# EAGLE design RC_RX_CABELL_V3_FHSS_No_Diversity_No_SBUS (EAGLE 7.5.0)
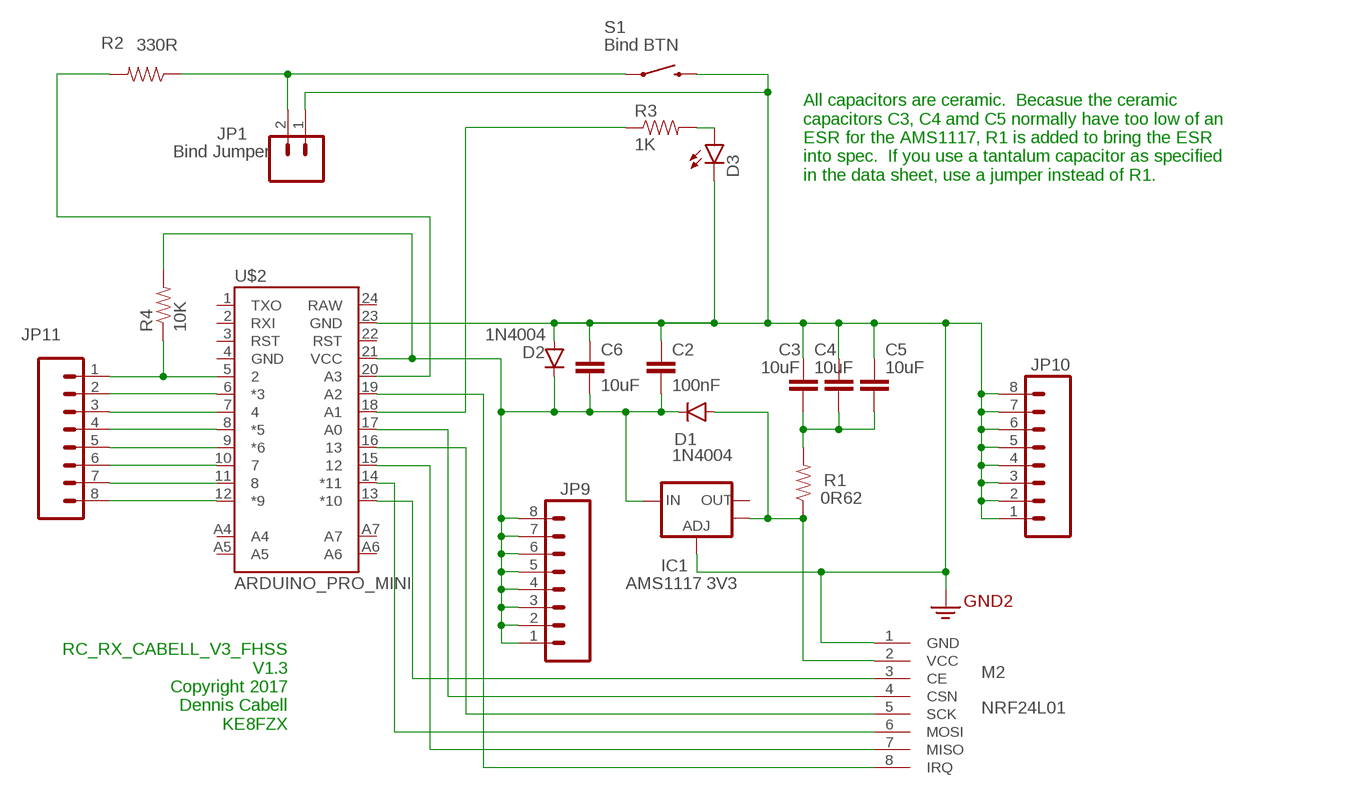
[diagram p0: schematic, sheet 1]

## Parts
C2  100nF  CAPPTH1  [CAP-PTH-5MM]
C3  10uF  CAPPTH1  [CAP-PTH-5MM]
C4  10uF  CAPPTH1  [CAP-PTH-5MM]
C5  10uF  CAPPTH1  [CAP-PTH-5MM]
C6  10uF  CAPPTH1  [CAP-PTH-5MM]
D1  1N4004  DIODEPTH  [DIODE-1N4001]
D2  1N4004  DIODEPTH  [DIODE-1N4001]
D3  LED3MM  [LED3MM]
IC1  AMS1117 3V3  V_REG_LM1117SOT223  [SOT223]
JP1  Bind Jumper  M02PTH  [1X02]
JP9  M08  [1X08_ROUND]
JP10  M08  [1X08_ROUND]
JP11  M08  [1X08_ROUND]
M2  NRF24L01  WIRELESS-NRF24L01  [WIRELESS-NRF24L01]
R1  0R62  RESISTORPTH-1/2W  [AXIAL-0.5]
R2  330R  RESISTORAXIAL-0.3  [AXIAL-0.3]
R3  1K  RESISTORAXIAL-0.3  [AXIAL-0.3]
R4  10K  RESISTORAXIAL-0.3  [AXIAL-0.3]
S1  Bind BTN  SWITCH-MOMENTARY-2SMD-1101NE  [TACTILE-SWITCH-1101NE]
U$2  ARDUINO_PRO_MINI  [ARDUINO_PRO_MINI]

## Nets
5V: C2.2 C6.2 D1.C D2.C IC1.3(IN) JP9.1 JP9.2 JP9.3 JP9.4 JP9.5 JP9.6 JP9.7 JP9.8 R4.P$2 U$2.21(VCC)
GND: C2.1 C3.1 C4.1 C5.1 C6.1 D2.A D3.K(C) IC1.1(ADJ) JP1.1 JP10.1 JP10.2 JP10.3 JP10.4 JP10.5 JP10.6 JP10.7 JP10.8 M2.1(GND) S1.2 U$2.23(GND) ; supply symbol labelled GND2
N$1: JP11.1 R4.P$1 U$2.5
N$3: M2.3(CE) U$2.13(*10)
N$5: JP11.2 U$2.6(*3)
N$6: JP11.3 U$2.7
N$7: JP11.4 U$2.8(*5)
N$8: JP11.5 U$2.9(*6)
N$9: JP11.6 U$2.10
N$10: JP11.7 U$2.11
N$11: JP11.8 U$2.12(*9)
N$12: JP1.2 R2.P$1 S1.1
N$13: M2.8(IRQ) U$2.19(A2)
N$14: C3.2 C4.2 C5.2 R1.P$2
N$15: M2.5(SCK) U$2.16
N$18: M2.4(CSN) U$2.17(A0)
N$19: D3.A R3.P$2
N$20: M2.6(MOSI) U$2.14(*11)
N$21: R3.P$1 U$2.18(A1)
N$22: M2.7(MISO) U$2.15
N$24: R2.P$2 U$2.20(A3)
VCC: D1.A IC1.4(OUT) M2.2(VCC) R1.P$1
Unconnected: IC1.2(OUT) U$2.1(TXO) U$2.2(RXI) U$2.3(RST) U$2.4(GND) U$2.22(RST) U$2.24(RAW) U$2.A4 U$2.A5 U$2.A6 U$2.A7

## Notes on the sheet
- All capacitors are ceramic.  Becasue the ceramic
  capacitors C3, C4 amd C5 normally have too low of an
  ESR for the AMS1117, R1 is added to bring the ESR
  into spec.  If you use a tantalum capacitor as specified
  in the data sheet, use a jumper instead of R1.
- RC_RX_CABELL_V3_FHSS
  V1.3
  Copyright 2017
  Dennis Cabell
  KE8FZX

## Library data of the parts
C2-C6 = SparkFun-Passives:CAP: Capacitor Standard 0603 ceramic capacitor, and 0.1" leaded capacitor.
D1 D2 = SparkFun-DiscreteSemi:DIODE: Diode These are standard reverse protection diodes and small signal diodes. SMA package can handle up to about 1A. SOD-323 can handle about 200mA. What the SOD-323 package when ordering, there are some mfgs out there that are 5-pin packages.
D3 = SparkFun-LED:LED: LEDs Standard schematic elements and footprints for 5mm, 3mm, 1206, and 0603 sized LEDs. 5mm - Spark Fun Electronics SKU : COM-00529 (and others)
IC1 = SparkFun-PowerIC:V_REG_LM1117: Voltage Regulator LM1117 Standard adjustable voltage regulator but in SMD form. Spark Fun Electronics SKU : COM-00595; PROD_ID: VREG-08170
JP1 = SparkFun-Connectors:M02: Standard 2-pin 0.1" header. Use with - straight break away headers ( PRT-00116) - right angle break away headers (PRT-00553) - swiss pins (PRT-00743) - machine pins (PRT-00117) - female headers (PRT-00115) Molex polarized connector foot print use with: PRT-08233 with associated crimp pins and housings. 2.54_SCREWTERM for use with PRT-10571. 3.5mm Screw Terminal footprints for PRT-08084 5mm Screw Terminal footprints for use with PRT-08432
JP9-JP11 = SparkFun-Connectors:M08: Header 8 Standard 8-pin 0.1" header. Use with straight break away headers (SKU : PRT-00116), right angle break away headers (PRT-00553), swiss pins (PRT-00743), machine pins (PRT-00117), and female headers (PRT-00115).
M2 = diy-modules:WIRELESS-NRF24L01: 2.4 GHz Wireless Module based on NRF24L01 chip
R1-R4 = SparkFun-Passives:RESISTOR: Resistor Basic schematic elements and footprints for 0603, 1206, and PTH resistors.
S1 = SparkFun-Electromechanical:SWITCH-MOMENTARY-2: Various NO switches- pushbuttons, reed, etc; PROD_ID: SWCH-00815
U$2 = SparkFun-Boards:ARDUINO_PRO_MINI

## Board
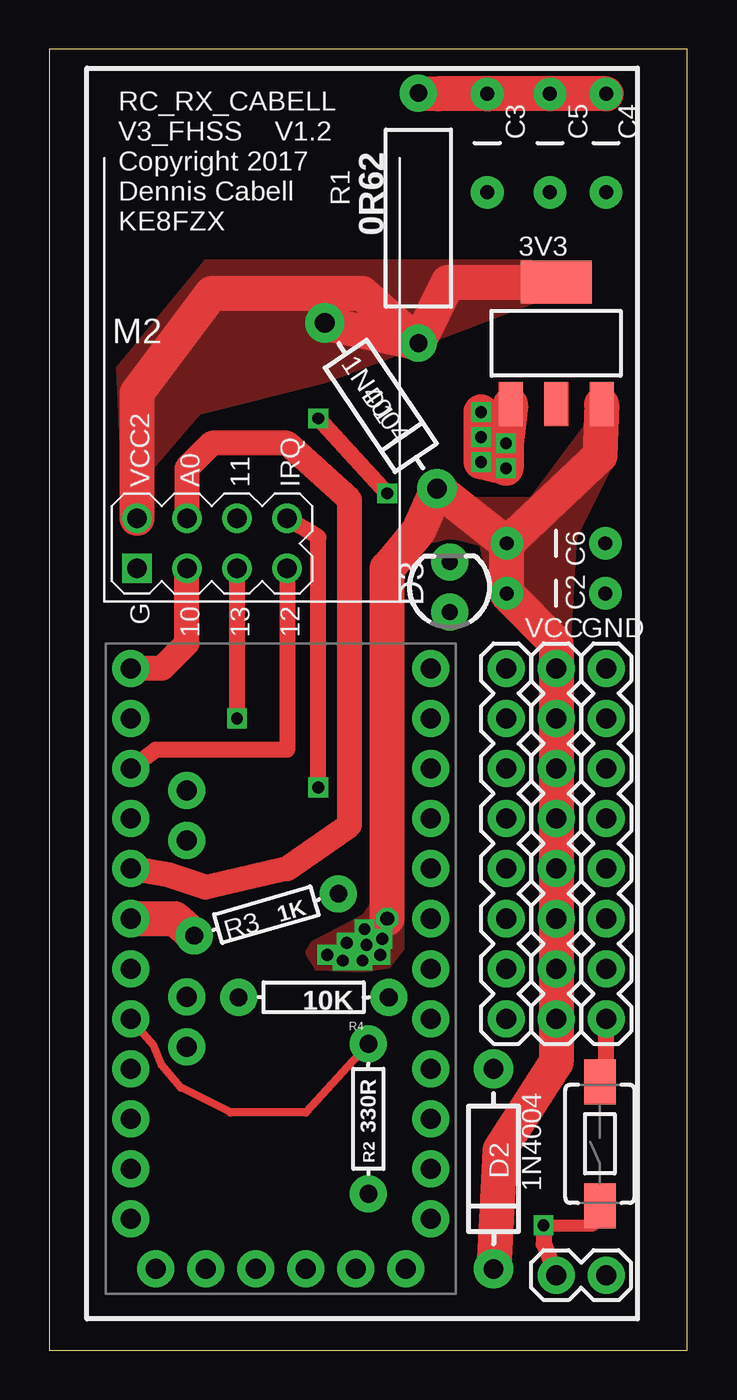
[diagram p1: board, top side]
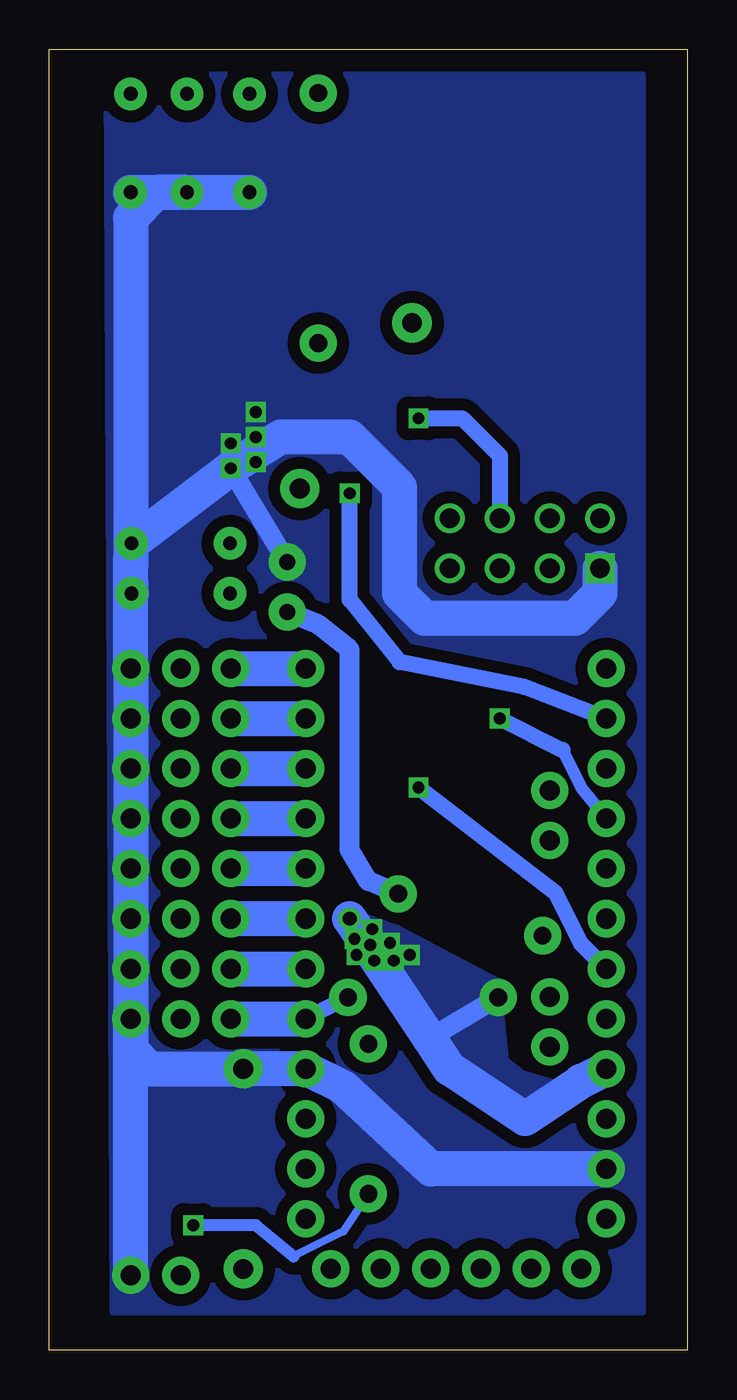
[diagram p2: board, bottom side, seen from below]

Size 32.39 x 66.04 mm. Coordinates in mm from the lower left corner, seen from the top.
Outline: 0,0 32.39,0 32.39,66.04 0,66.04 0,0
Copper layers (1*16): Top 0.035mm / dielectric 1.5mm / Bottom 0.035mm
Design rules "default": minimum track width 10mil, minimum drill 24mil, track to track 8mil, track to pad 8mil, pad to pad 8mil, via to via 8mil, smd to smd 8mil, copper to edge 40mil, drill to drill 8mil, minimum pad ring 10mil, minimum via ring 8mil, stop-mask expansion 4mil, vias tented up to drill 0mil, thermal gap 10mil

### Footprints (pad centres in the part's own frame; a part is rotated, then mirrored left to right if it is on the bottom)
CAP-PTH-5MM = drill 0.7 pad 1.651: 1 -2.5,0; 2 2.5,0
DIODE-1N4001 = drill 1 pad 1.981: A -5.08,0; C 5.08,0
LED3MM = drill 0.813 pad 1.88: A -1.27,0; K 1.27,0
SOT223 = smd 1.219 x 2.235: 1 -2.311,-3.099; 2 0,-3.099; 3 2.311,-3.099 | smd 3.6 x 2.2: 4 0,3.099
1X02 = drill 1.016 pad 1.88: 1 0,0; 2 2.54,0
1X08_ROUND = drill 1.016 pad 1.88: 1 0,0; 2 2.54,0; 3 5.08,0; 4 7.62,0; 5 10.16,0; 6 12.7,0; 7 15.24,0; 8 17.78,0
WIRELESS-NRF24L01 = drill 1 square: 1 -12.7,6.35 | drill 1: 2 -10.16,6.35; 3 -12.7,3.81; 4 -10.16,3.81; 5 -12.7,1.27; 6 -10.16,1.27; 7 -12.7,-1.27; 8 -10.16,-1.27
AXIAL-0.5 = drill 0.9 pad 1.88: P$1 -6.35,0; P$2 6.35,0
AXIAL-0.3 = drill 0.9 pad 1.88: P$1 -3.81,0; P$2 3.81,0
TACTILE-SWITCH-1101NE = smd 2.3 x 1.6: 1 -3.15,0; 2 3.15,0
ARDUINO_PRO_MINI = drill 1.016 pad 1.88: 1 -7.62,12.7; 2 -7.62,10.16; 3 -7.62,7.62; 4 -7.62,5.08; 5 -7.62,2.54; 6 -7.62,0; 7 -7.62,-2.54; 8 -7.62,-5.08; 9 -7.62,-7.62; 10 -7.62,-10.16; 11 -7.62,-12.7; 12 -7.62,-15.24; 13 7.62,-15.24; 14 7.62,-12.7; 15 7.62,-10.16; 16 7.62,-7.62; 17 7.62,-5.08; 18 7.62,-2.54; 19 7.62,0; 20 7.62,2.54; 21 7.62,5.08; 22 7.62,7.62; 23 7.62,10.16; 24 7.62,12.7; A4 4.763,1.429; A5 4.763,3.969; A6 4.763,-9.049; A7 4.763,-6.509; BLK -6.35,15.24; GND -3.81,15.24; GRN 6.35,15.24; RXI 1.27,15.24; TXO 3.81,15.24; VCC -1.27,15.24

### Placement (x,y rotation side)
C2  25.72,38.42 180 top
C3  22.23,61.28 90 top
C4  28.26,61.28 90 top
C5  25.4,61.28 90 top
C6  25.72,40.96 180 top
D1  16.83,47.94 304.1 top
D2  22.54,9.21 270 top
D3  20.32,38.73 90 top
IC1  25.72,51.12 0 top
JP1  28.26,3.81 180 top
JP9  25.72,16.83 90 top
JP10  28.26,16.83 90 top
JP11  23.18,16.83 90 top
M2  10.8,52.39 90 top
R1  18.73,57.47 90 top
R2  16.19,11.75 90 top
R3  11.01,22.11 16.2 top
R4  13.42,17.91 180 top
S1  27.94,10.48 90 top
U$2  11.75,19.37 180 top

### Tracks (layer width: path | path; a pad name or v marks a point on that pad's centre or on a via)
5V  (via drill 0.6, 0.7)
  Top 1.778: v17.14,21.91 17.14,39.69 18.73,41.59 D1.C C6.2 | C6.2 C2.2 25.72,35.88 JP9.8 JP9.7 JP9.6 JP9.5 JP9.4 JP9.3 JP9.2 JP9.1 25.72,14.6 22.86,10.16 D2.C | IC1.3 27.94,45.4 C6.2
  Bottom 0.254: 16.61,21.1 v16.8,20.08 v16.9,20.88 v16,21.38 | v16.1,20.58 15.56,20.95 | v15.9,19.77 v14.1,20.08
  Bottom 1.016: R4.P$2 13.09,15.83
  Bottom 1.778: v17.14,21.91 13.09,15.83 12.06,14.29 8.26,11.75 5.4,13.65 U$2.21
  other vias: 15.1,20.67 14.9,19.77
  pour Top (no thermals): 20.64,41.27 21.91,40.96 22.54,38.1 26.35,35.88 26.67,41.27 28.58,45.09 28.26,47.94 27.3,46.99 24.45,43.18 21.27,43.18 18.1,41.59 18.1,40.96
  pour Bottom (no thermals): 16.83,22.23 14.7,21.48 9.6,18.77 9.2,14.78 8.3,14.08 6.5,13.58 7.2,11.97 11.3,13.37
  pour Top (no thermals): 17.9,22.48 17.9,20.38 17.2,19.48 15.9,19.27 13.6,19.38 13.1,20.17 13.4,20.67 15.5,21.77 16,22.08 16.5,22.77
GND  (via drill 0.6)
  Top 0.813: S1.2 28.26,13.33 JP10.1
  Top 1.778: IC1.1 v23.18,46.04 v23.18,44.77 v21.91,45.09 v21.91,46.36 v21.91,47.62
  Bottom 1.016: D3.K v23.18,44.77
  Bottom 1.778: JP10.1 28.26,17.15 JP10.2 JP10.3 JP10.4 JP10.5 JP10.6 JP10.7 JP10.8 28.26,38.38 28.24,38.41 | 28.24,38.41 C6.1 | C4.1 C5.1 | C5.1 C3.1 | C5.1 26.95,58.78 28.26,57.47 28.26,39.73 | 28.26,39.73 C6.1 | 28.25,38.42 28.24,38.41 | 28.24,38.41 28.25,38.41 | C2.1 28.26,39.73 | C6.1 v23.18,44.77 20.64,46.36 17.14,46.36 14.6,43.82 14.6,38.42 13.34,37.15 5.71,37.15 4.45,38.42 M2.1 | JP10.1 28.26,15.24 27.31,14.29 D2.A 19.37,14.29 17.46,13.33 13.02,9.21 U$2.23 | JP1.1 JP10.1
  pour Bottom (isolate 0.61, no thermals): 2.22,64.77 29.53,64.77 29.21,1.9 2.22,1.9
N$1
  Bottom 0.813: R4.P$1 U$2.5
  Bottom 1.778: JP11.1 U$2.5
N$3
  Top 1.27: M2.3 6.99,35.88 5.71,34.61 U$2.13
N$5
  Bottom 1.778: JP11.2 U$2.6
N$6
  Bottom 1.778: JP11.3 U$2.7
N$7
  Bottom 1.778: JP11.4 U$2.8
N$8
  Bottom 1.778: JP11.5 U$2.9
N$9
  Bottom 1.778: JP11.6 U$2.10
N$10
  Bottom 1.778: JP11.7 U$2.11
N$11
  Bottom 1.778: JP11.8 U$2.12
N$12  (via drill 0.6)
  Top 0.61: v25.08,6.35 27.62,6.35 S1.1
  Top 0.813: v25.08,6.35 25.08,5.4 JP1.2
  Bottom 0.406: R2.P$1 17.46,6.03 20,4.76
  Bottom 0.61: 20,4.76 21.91,6.35 v25.08,6.35
N$13  (via drill 0.6)
  Top 0.813: v13.65,28.58 13.65,41.27 M2.8
  Bottom 0.813: U$2.19 5.4,20.64 6.67,23.18 v13.65,28.58
N$14
  Top 1.778: C4.2 C5.2 C3.2 19.73,63.78 R1.P$2
N$15  (via drill 0.6)
  Top 0.813: M2.5 v9.52,32.07
  Bottom 0.61: 6.35,30.48 5.4,28.58 U$2.16
  Bottom 0.813: v9.52,32.07 6.35,30.48
N$18
  Top 1.27: M2.4 6.99,44.77 8.26,46.04 12.06,46.04 15.24,43.18 15.24,26.67 12.06,24.45 7.94,23.5 6.03,24.13 U$2.17
N$19
  Bottom 1.016: R3.P$2 16.19,23.81 17.14,25.4 17.14,35.56 18.73,36.83 D3.A
N$20  (via drill 0.6)
  Top 0.813: v17.14,43.5 v13.65,47.31
  Bottom 0.813: U$2.14 8.26,33.66 14.6,34.93 17.14,38.1 v17.14,43.5 | v13.65,47.31 11.43,47.31 9.52,45.4 M2.6
N$21
  Top 1.778: U$2.18 6.35,21.91 R3.P$1
N$22
  Top 0.813: M2.7 12.06,30.48 5.4,30.48 U$2.15
N$24
  Top 0.406: R2.P$2 13.02,12.06 9.21,12.06 6.67,13.33 5.7,14.47 5.3,15.47 U$2.20
VCC
  Top 1.778: R1.P$1 20.24,54.22 IC1.4 | M2.2 4.45,48.58 8.26,53.66 15.88,53.66 R1.P$1 | D1.A R1.P$1
  pour Top (no thermals): 24.45,55.24 7.94,55.24 3.49,49.85 3.81,43.18 7.62,47.62 13.97,49.21 24.77,53.34

### Text on the board
tSilk: RC_RX_CABELL / V3_FHSS V1.2 / Copyright 2017 / Dennis Cabell / KE8FZX | 3V3 | VCC2 | A0 | 11 | IRQ | G | 10 | 13 | 12 | VCC | GND